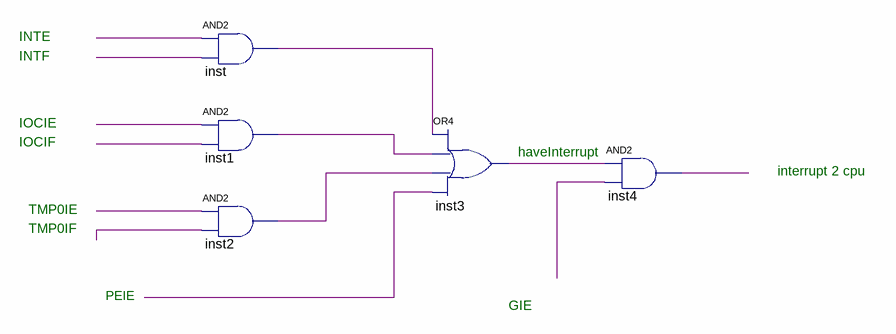
[diagram p0: schematic sheet]
// Quartus schematic Block1.bdf as structural Verilog: 5 symbols, 0 pins
module Block1 (
);

  wire inst1_out, inst2_out, inst3_out, inst4_out, inst_out, undriven, undriven_2, undriven_3, undriven_4,
       undriven_5, undriven_6, undriven_7, undriven_8;

  and inst (inst_out, undriven, undriven_2);
  and inst1 (inst1_out, undriven_3, undriven_4);
  and inst2 (inst2_out, undriven_5, undriven_6);
  or inst3 (inst3_out, inst_out, inst1_out, inst2_out, undriven_7);
  and inst4 (inst4_out, inst3_out, undriven_8);

  // Notes on the sheet:
  //   INTE
  //   INTF
  //   IOCIE
  //   IOCIF
  //   haveInterrupt
  //   interrupt 2 cpu
  //   TMP0IE
  //   TMP0IF
  //   PEIE
  //   GIE
endmodule
